# Altium schematic sheet 04-POWERV2.1.SchDoc
size A4
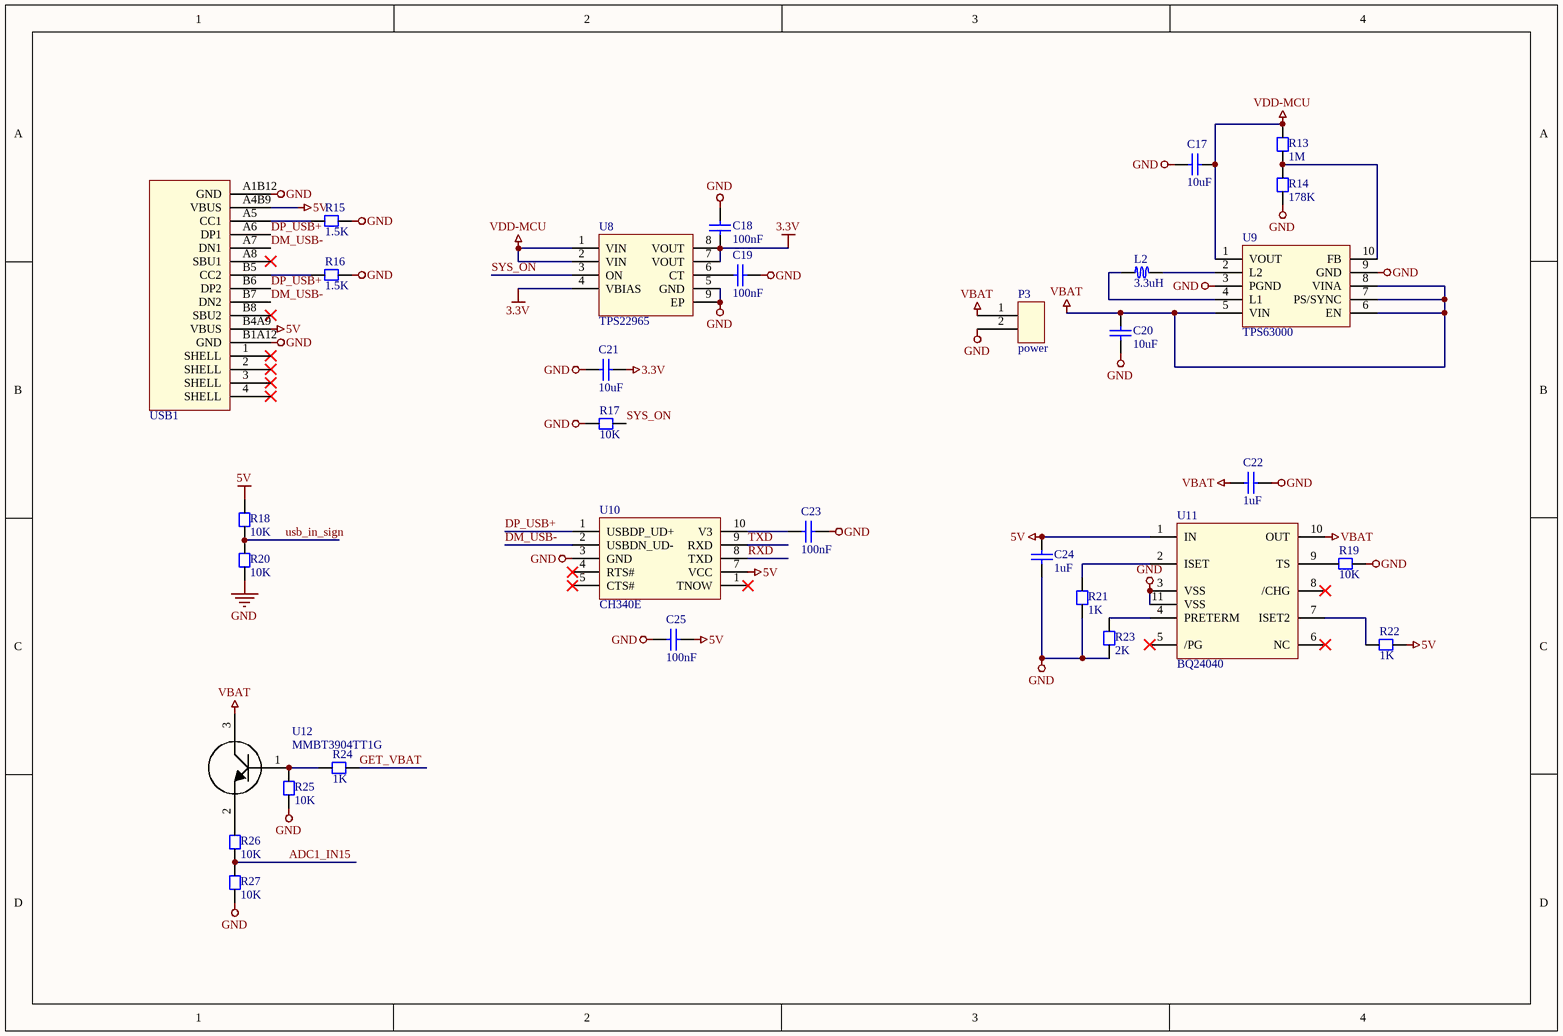
[diagram p0: 04-POWERV2.1.SchDoc]

## Parts
C17  10uF  [CC1005-0402]
C18  100nF  [CC1005-0402]
C19  100nF  [CC1005-0402]
C20  10uF  [CC1005-0402]
C21  10uF  [CC1005-0402]
C22  1uF  [CC1005-0402]
C23  100nF  [CC1005-0402]
C24  1uF  [CC1005-0402]
C25  100nF  [CC1005-0402]
L2  3.3uH  [Inductor-0805]
P3  power  [POWER-3.7V]
R13  1M  [CR1005-0402]
R14  178K  [CR1005-0402]
R15  1.5K  [CR1005-0402]
R16  1.5K  [CR1005-0402]
R17  10K  [CR1005-0402]
R18  10K  [CR1005-0402]
R19  10K  [CR1005-0402]
R20  10K  [CR1005-0402]
R21  1K  [CR1005-0402]
R22  1K  [CR1005-0402]
R23  2K  [CR1005-0402]
R24  1K  [CR1005-0402]
R25  10K  [CR1005-0402]
R26  10K  [CR1005-0402]
R27  10K  [CR1005-0402]
U8  TPS22965  [UDFN-8]
U9  TPS63000  [SON10]
U10  CH340E  [MSOP-10]
U11  BQ24040  [WSON-10_L2.0-W2.0-P0.40-BL-EP]
U12  MMBT3904TT1G  [SOT-416]
USB1  Tpye-c 16P  [TYPE-C 16P]  (value not drawn)

## Nets
3.3V: C18.1 C21.2 U8.4(VBIAS) U8.7(VOUT) U8.8(VOUT)
5V: C24.1 C25.2 R18.1 R22.2 U10.7(VCC) U11.1(IN) USB1.A4B9(VBUS) USB1.B4A9(VBUS)
GND: C17.1 C18.2 C19.1 C20.1 C21.1 C22.1 C23.2 C24.2 C25.1 P3.2 R14.1 R15.1 R16.1 R17.2 R19.2 R20.2 R21.2 R23.2 R25.2 R27.2 U8.5(GND) U8.9(EP) U9.3(PGND) U9.9(GND) U10.3(GND) U11.3(VSS) U11.11(VSS) USB1.A1B12(GND) USB1.B1A12(GND)
VBAT: C20.2 C22.2 P3.1 U9.5(VIN) U9.6(EN) U9.7(PS/SYNC) U9.8(VINA) U11.10(OUT) U12.3
VDD-MCU: C17.2 R13.1 U8.1(VIN) U8.2(VIN) U9.1(VOUT)
ADC1_IN15: R26.2 R27.1
DM_USB-: U10.2(USBDN_UD-) USB1.A7(DN1) USB1.B7(DN2)
DP_USB+: U10.1(USBDP_UD+) USB1.A6(DP1) USB1.B6(DP2)
GET_VBAT: R24.2
RXD: U10.8(TXD)
SYS_ON: R17.1 U8.3(ON)
TXD: U10.9(RXD)
usb_in_sign: R18.2 R20.1
NetC19_2: C19.2 U8.6(CT)
NetC23_1: C23.1 U10.10(V3)
NetL2_1: L2.1 U9.4(L1)
NetL2_2: L2.2 U9.2(L2)
NetR13_2: R13.2 R14.2 U9.10(FB)
NetR15_2: R15.2 USB1.A5(CC1)
NetR16_2: R16.2 USB1.B5(CC2)
NetR19_1: R19.1 U11.9(TS)
NetR21_1: R21.1 U11.2(ISET)
NetR22_1: R22.1 U11.7(ISET2)
NetR23_1: R23.1 U11.4(PRETERM)
NetR24_1: R24.1 R25.1 U12.1
NetR26_1: R26.1 U12.2

Not connected (* = marked no-connect by the designer): U10 4(RTS#)* 5(CTS#)*; U11 5(/PG)* 6(NC)* 8(/CHG)*; USB1 1(SHELL)* 2(SHELL)* 3(SHELL)* 4(SHELL)* A8(SBU1)* B8(SBU2)*

## Library data of the parts
C17-C25 = Chip capacitor: 贴片电容
L2 = Chip inductor: 贴片电感
R13-R27 = Chip resistor: 贴片电阻
U8 = TPS22965: DFN-8 功率开关芯片 TPS22965DSGR
U9 = TPS63000: 宽电压电源转换芯片输出3.3V输入1V至6V
U10 = CH340E: usd转串口芯片 MSOP10封装
U11 = BQ24041: 1A 具有自动启动功能的单输入，单节锂离子和锂聚合物电池充电 / 器 /
U12 = MMBT3904TT1G: NPN 电流 - 集电极（Ic）（最大值）：200mA 电压 - 集射极击穿（最大值）：40V SOT-23-3
USB1 = Tpye-c 16P: 16P 封装的TYPE -c接口 4固定插脚 双向